# EAGLE design ProtoShieldBasic (EAGLE 6.3)
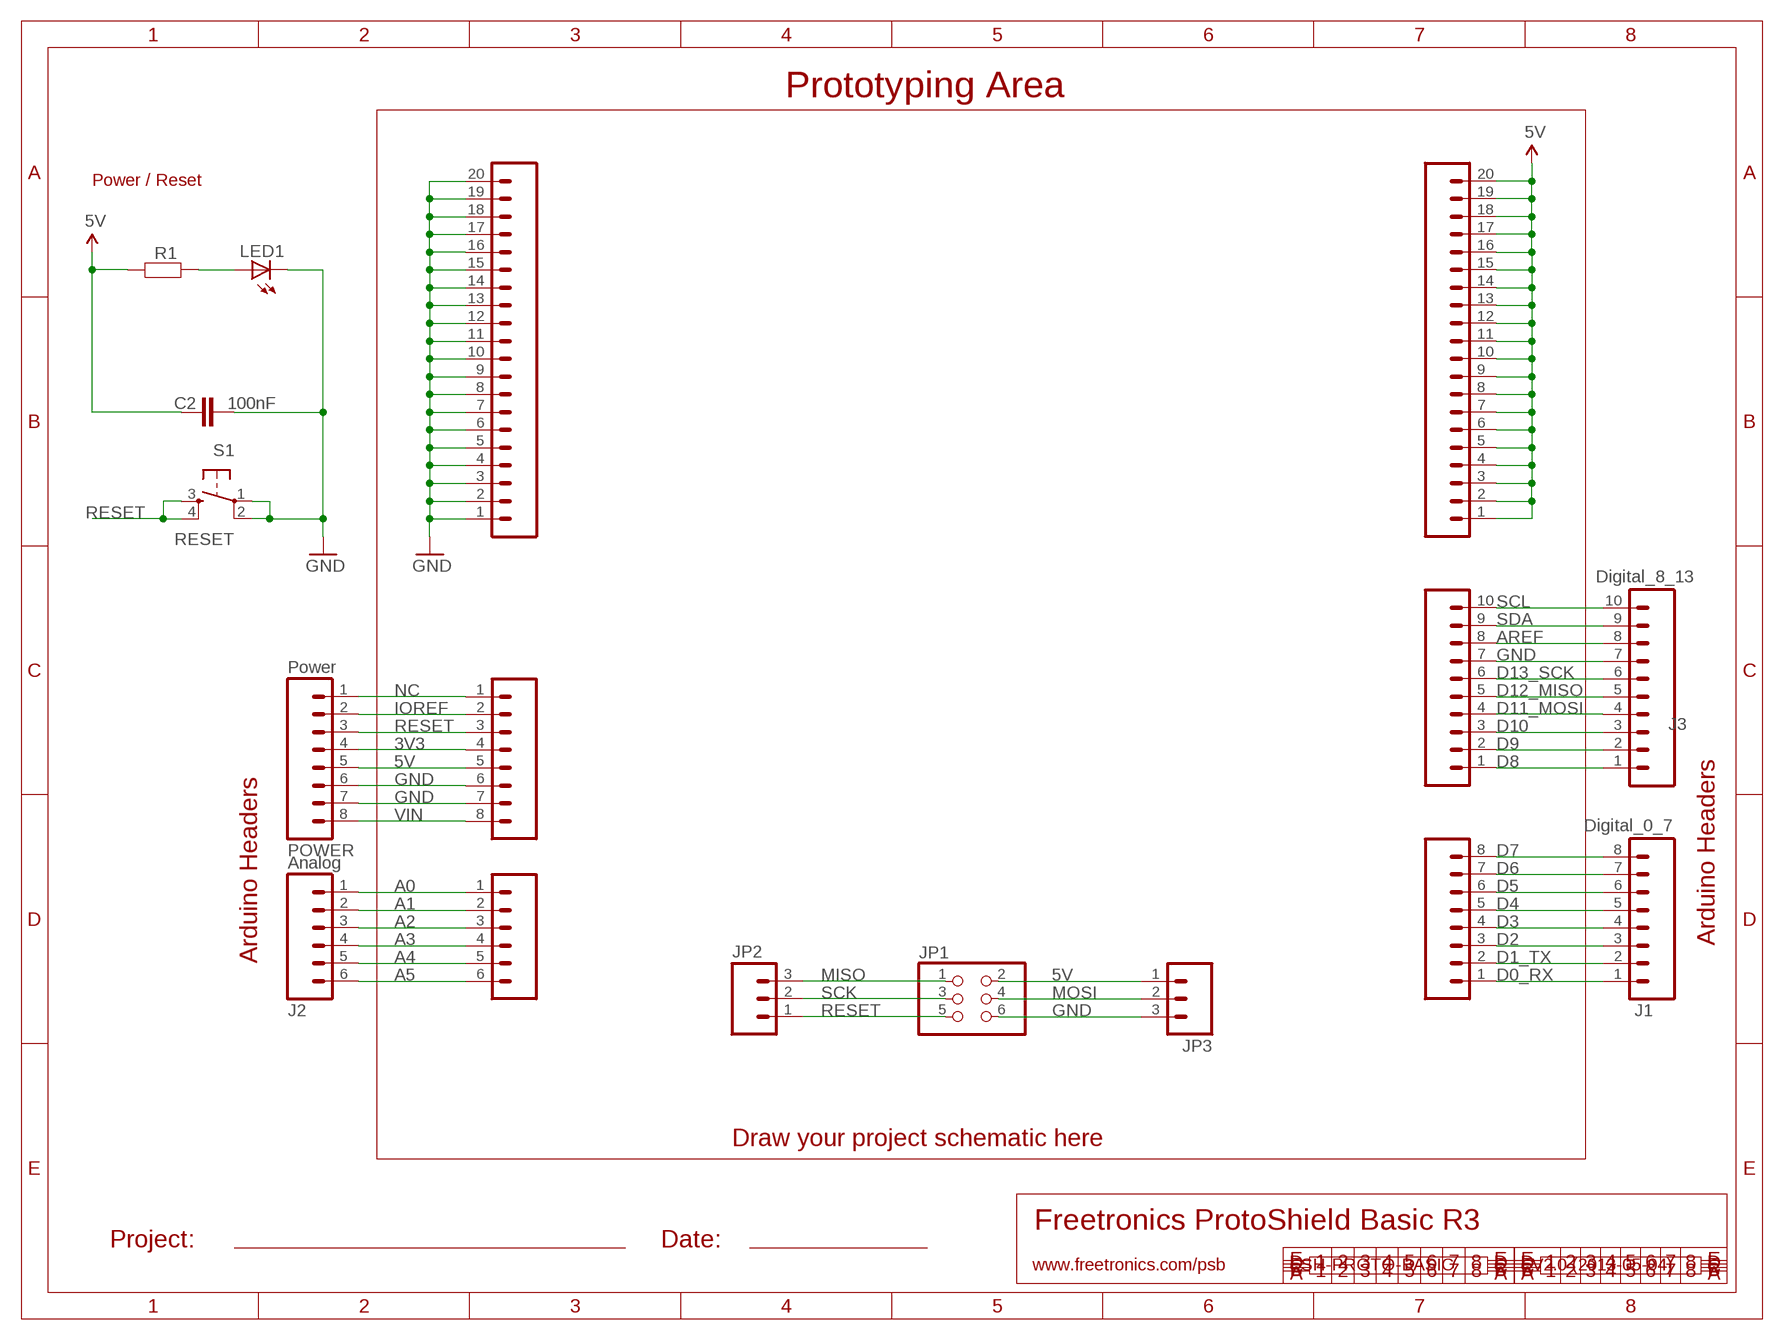
[diagram p0: schematic, sheet 1]

## Parts
C2  100nF  CAPPTH  [CAP-PTH-SMALL]
J1  Digital_0_7  M08  [1X08]
J2  Analog  M06SIP  [1X06]
J3  Digital_8_13  M100.1  [1X10]
JP1  PINHD-2X3  [2X03]
JP2  M03PTH  [1X03]
JP3  M03PTH  [1X03]
LED1  LED3MM  [LED3MM]
PADS_5V  M20  [1X20]
PADS_GND  M20  [1X20]
POWER  Power  M08  [1X08]
R1  RESISTORPTH1  [AXIAL-0.3]
S1  RESET  TAC_SWITCHPTH  [TACTILE-PTH]
SL1  Digital_0_7  M08  [1X08]
SL2  Analog  M06SIP  [1X06]
SL3  Digital_8_13  M100.1  [1X10]
SLP  Power  M08  [1X08]

## Nets
3V3: POWER.4 SLP.4
5V: C2.1 JP1.2 JP3.1 PADS_5V.1 PADS_5V.2 PADS_5V.3 PADS_5V.4 PADS_5V.5 PADS_5V.6 PADS_5V.7 PADS_5V.8 PADS_5V.9 PADS_5V.10 PADS_5V.11 PADS_5V.12 PADS_5V.13 PADS_5V.14 PADS_5V.15 PADS_5V.16 PADS_5V.17 PADS_5V.18 PADS_5V.19 PADS_5V.20 POWER.5 R1.P$1 SLP.5
A0: J2.1 SL2.1
A1: J2.2 SL2.2
A2: J2.3 SL2.3
A3: J2.4 SL2.4
A4: J2.5 SL2.5
A5: J2.6 SL2.6
AREF: J3.8 SL3.8
D0_RX: J1.1 SL1.1
D1_TX: J1.2 SL1.2
D2: J1.3 SL1.3
D3: J1.4 SL1.4
D4: J1.5 SL1.5
D5: J1.6 SL1.6
D6: J1.7 SL1.7
D7: J1.8 SL1.8
D8: J3.1 SL3.1
D9: J3.2 SL3.2
D10: J3.3 SL3.3
D11_MOSI: J3.4 SL3.4
D12_MISO: J3.5 SL3.5
D13_SCK: J3.6 SL3.6
GND: C2.2 J3.7 JP1.6 JP3.3 LED1.K(C) PADS_GND.1 PADS_GND.2 PADS_GND.3 PADS_GND.4 PADS_GND.5 PADS_GND.6 PADS_GND.7 PADS_GND.8 PADS_GND.9 PADS_GND.10 PADS_GND.11 PADS_GND.12 PADS_GND.13 PADS_GND.14 PADS_GND.15 PADS_GND.16 PADS_GND.17 PADS_GND.18 PADS_GND.19 PADS_GND.20 POWER.6 POWER.7 S1.1 S1.2 SL3.7 SLP.6 SLP.7
IOREF: POWER.2 SLP.2
MISO: JP1.1 JP2.3
MOSI: JP1.4 JP3.2
N$1: LED1.A R1.P$2
NC: POWER.1 SLP.1
RESET: JP1.5 JP2.1 POWER.3 S1.3 S1.4 SLP.3
SCK: JP1.3 JP2.2
SCL: J3.10 SL3.10
SDA: J3.9 SL3.9
VIN: POWER.8 SLP.8

## Notes on the sheet
- Prototyping Area
- Power / Reset
- Arduino Headers
- Arduino Headers
- Draw your project schematic here
- Freetronics ProtoShield Basic R3
- Project: | Date:
- www.freetronics.com/psb | SH-PROTO-BASIC | V2.0 (2013-05-04)

## Library data of the parts
C2 = freetronics:CAP: Capacitor Standard 0603 ceramic capacitor, and 0.1" leaded capacitor.
J1 SL1 = freetronics:M08: Header 8 Standard 8-pin 0.1" header. Use with straight break away headers (SKU : PRT-00116), right angle break away headers (PRT-00553), swiss pins (PRT-00743), machine pins (PRT-00117), and female headers (PRT-00115).
J2 SL2 = freetronics:M06: Header 6 Standard 6-pin 0.1" header. Use with straight break away headers (SKU : PRT-00116), right angle break away headers (PRT-00553), swiss pins (PRT-00743), machine pins (PRT-00117), and female headers (PRT-00115). Molex polarized connector foot print use with SKU : PRT-08094 with associated crimp pins and housings. NOTES ON THE VARIANTS LOCK and LOCK_LONGPADS... This footprint was designed to help hold the alignment of a through-hole component (i.e. 6-pin header) while soldering it into place. You may notice that each hole has been shifted either up or down by 0.005 of an inch from it's more standard position (which is a perfectly straight line). This slight alteration caused the pins (the squares in the middle) to touch the edges of the holes. Because they are alternating, it causes a "brace" to hold the component in place. 0.005 has proven to be the perfect amount of "off-center" position when using our standard breakaway headers. Although looks a little odd when you look at the bare footprint, once you have a header in there, the alteration is very hard to notice. Also, if you push a header all the way into place, it is covered up entirely on the bottom side. This idea of altering the position of holes to aid alignment will be further integrated into the Sparkfun Library for other footprints. It can help hold any component with 3 or more connection pins.
J3 SL3 = freetronics-original:M10: Header 10 Standard 10-pin 0.1" header. Use with straight break away headers (SKU : PRT-00116), right angle break away headers (PRT-00553), swiss pins (PRT-00743), machine pins (PRT-00117), and female headers (PRT-00115).
JP1 = freetronics-master-v1.1:PINHD-2X3: PIN HEADER
JP2 JP3 = freetronics-master-v1.1:M03: Header 3 Standard 3-pin 0.1" header. Use with straight break away headers (SKU : PRT-00116), right angle break away headers (PRT-00553), swiss pins (PRT-00743), machine pins (PRT-00117), and female headers (PRT-00115). Molex polarized connector foot print use with SKU : PRT-08232 with associated crimp pins and housings.
LED1 = freetronics:LED: LEDs Standard schematic elements and footprints for 5mm, 3mm, 1206, and 0603 sized LEDs. 5mm - Spark Fun Electronics SKU : COM-00529 (and others)
PADS_5V PADS_GND = freetronics:M20: This is just like the LOCK variant in that the holes are staggared by 5 mil, but except for the last two holes. They are not altered from the "standard" footprint layout. This is used for a special purpose on the layout of our Graphic LCD Backpack. Make sure you want to use this device before selecting it for you project!
POWER SLP = freetronics-original:M08: Header 8 Standard 8-pin 0.1" header. Use with straight break away headers (SKU : PRT-00116), right angle break away headers (PRT-00553), swiss pins (PRT-00743), machine pins (PRT-00117), and female headers (PRT-00115).
R1 = freetronics:RESISTOR: Resistor Basic schematic elements and footprints for 0603, 1206, and PTH 1/10th watt (small) resistors.
S1 = freetronics:TAC_SWITCH: Momentary Switch Button commonly used for reset or general input. Spark Fun Electronics SKU : COM-00097

## Board
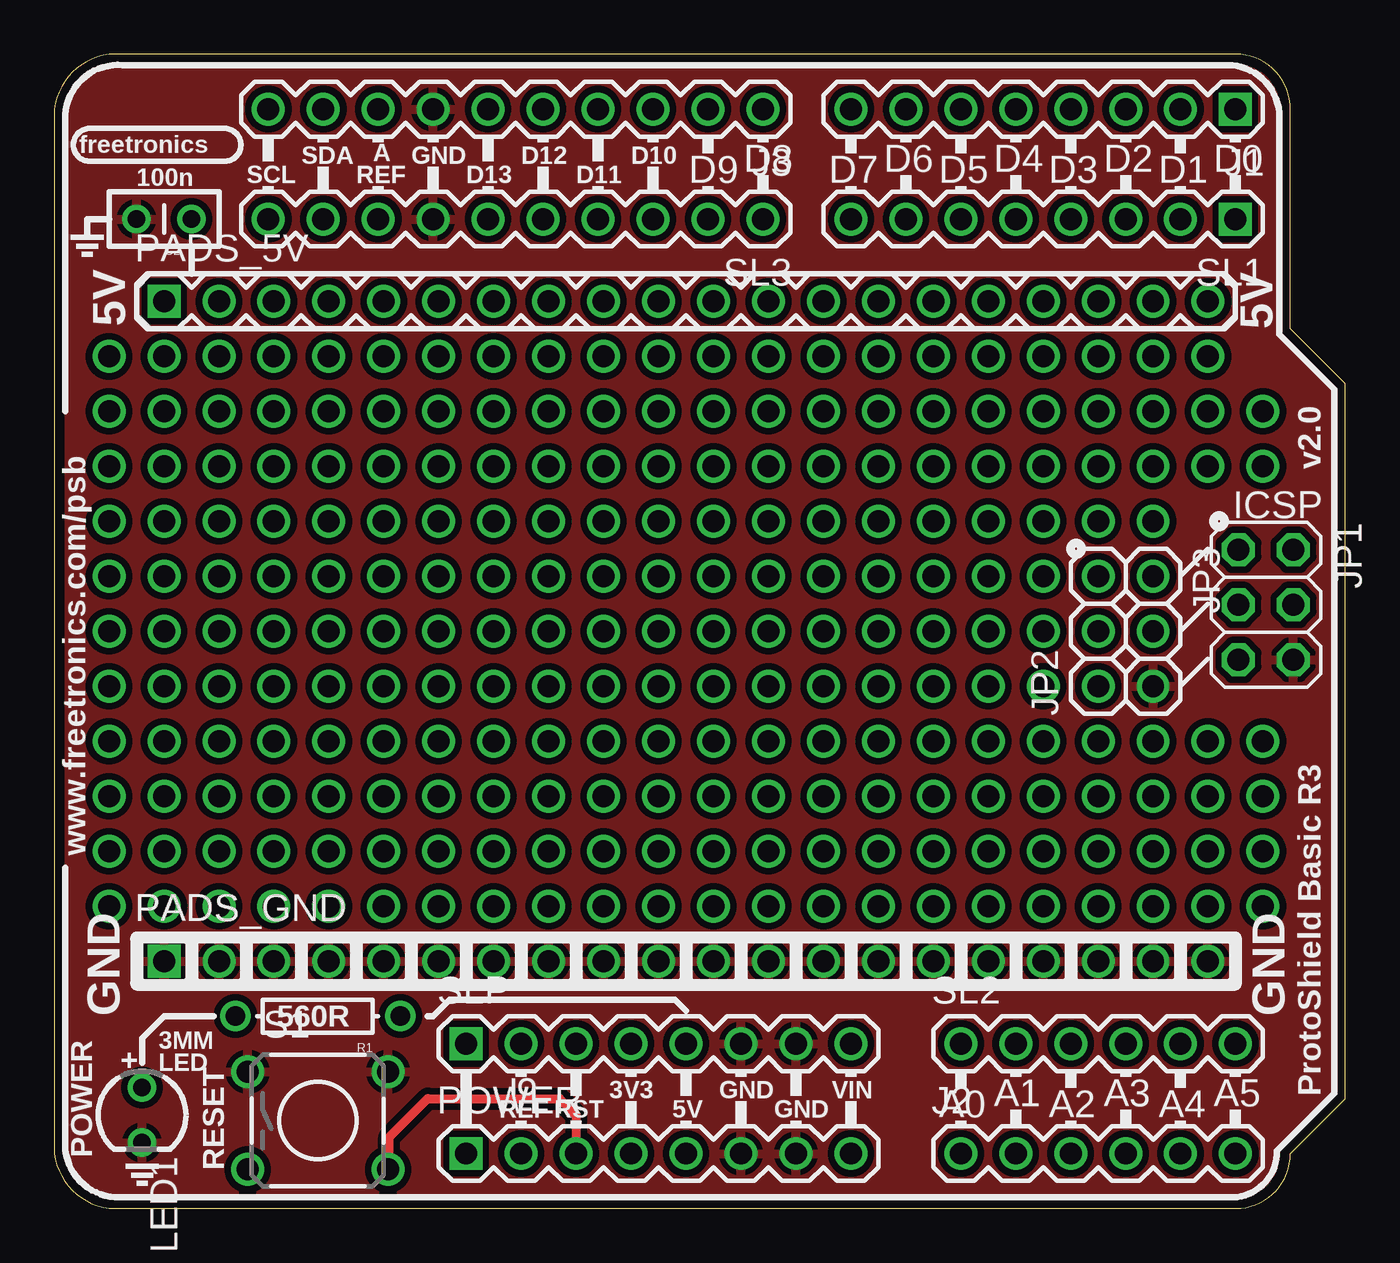
[diagram p1: board, top side]
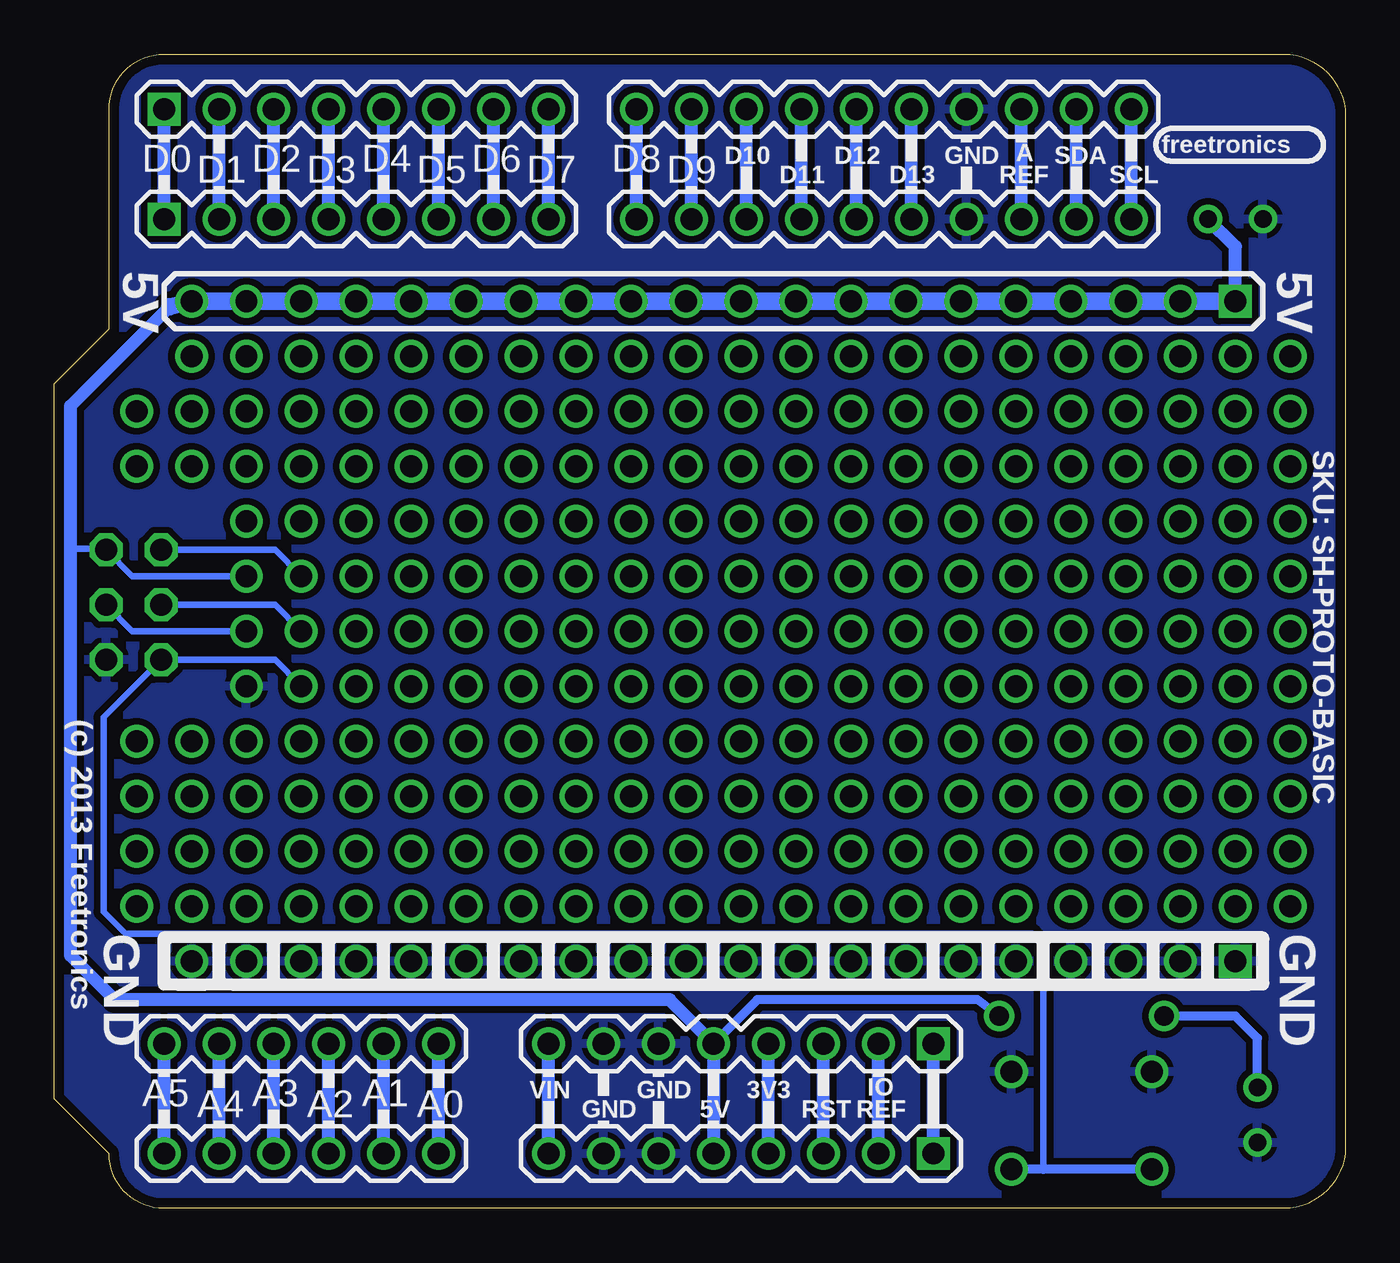
[diagram p2: board, bottom side, seen from below]

Size 59.69 x 53.34 mm. Coordinates in mm from the lower left corner, seen from the top.
Outline: 0,2.54 arc74 2.54,0 54.61,0 arc90 57.15,2.54 59.69,5.08 59.69,38.1 57.15,40.64 57.15,50.8 arc90 54.61,53.34 2.54,53.34 arc74 0,50.8 0,2.54
Copper layers (1*16): Top 0.035mm / dielectric 1.5mm / Bottom 0.035mm
Design rules "default *": minimum track width 10mil, minimum drill 24mil, track to track 12mil, track to pad 12mil, pad to pad 12mil, via to via 12mil, smd to smd 8mil, copper to edge 18mil, drill to drill 8mil, minimum pad ring 10mil, minimum via ring 8mil, stop-mask expansion 4mil, vias tented up to drill 0mil, thermal gap 10mil

### Footprints (pad centres in the part's own frame; a part is rotated, then mirrored left to right if it is on the bottom)
CAP-PTH-SMALL = drill 0.813: 1 0,0; 2 2.54,0
1X08 = drill 1.016 square: 1 0,0 | drill 1.016: 2 2.54,0; 3 5.08,0; 4 7.62,0; 5 10.16,0; 6 12.7,0; 7 15.24,0; 8 17.78,0
1X06 = drill 1.016: 1 0,0; 2 2.54,0; 3 5.08,0; 4 7.62,0; 5 10.16,0; 6 12.7,0
1X10 = drill 1.016: 1 0,0; 2 2.54,0; 3 5.08,0; 4 7.62,0; 5 10.16,0; 6 12.7,0; 7 15.24,0; 8 17.78,0; 9 20.32,0; 10 22.86,0
2X03 = drill 1.016 octagon: 1 -2.54,-1.27; 2 -2.54,1.27; 3 0,-1.27; 4 0,1.27; 5 2.54,-1.27; 6 2.54,1.27
1X03 = drill 1.016: 1 0,0; 2 2.54,0; 3 5.08,0
LED3MM = drill 0.813: A -1.27,0; K 1.27,0
1X20 = drill 1.016 square: 1 0,0 | drill 1.016: 2 2.54,0; 3 5.08,0; 4 7.62,0; 5 10.16,0; 6 12.7,0; 7 15.24,0; 8 17.78,0; 9 20.32,0; 10 22.86,0; 11 25.4,0; 12 27.94,0; 13 30.48,0; 14 33.02,0; 15 35.56,0; 16 38.1,0; 17 40.64,0; 18 43.18,0; 19 45.72,0; 20 48.26,0
AXIAL-0.3 = drill 0.9: P$1 -3.81,0; P$2 3.81,0
TACTILE-PTH = drill 1.016: 1 -3.251,2.261; 2 3.251,2.261; 3 -3.251,-2.261; 4 3.251,-2.261

### Placement (x,y rotation side)
C2  6.35,45.72 180 top
J1  54.61,50.8 180 top
J2  41.91,2.54 0 top
J3  32.77,50.8 180 top
JP1  56.02,27.89 270 top
JP2  48.26,24.13 90 top
JP3  50.8,29.21 270 top
LED1  4.06,4.32 270 top
PADS_5V  5.08,41.91 0 top
PADS_GND  5.08,11.43 0 top
POWER  19.05,2.54 0 top
R1  12.19,8.89 180 top
S1  12.19,4.06 0 top
SL1  54.61,45.72 180 top
SL2  41.91,7.62 0 top
SL3  32.77,45.72 180 top
SLP  19.05,7.62 0 top

### Tracks (layer width: path | path; a pad name or v marks a point on that pad's centre or on a via)
3V3
  Bottom 0.61: POWER.4 SLP.4
5V
  Bottom 0.305: JP3.1 56.07,29.21 JP1.2 57.34,30.48 58.93,30.48
  Bottom 0.406: R1.P$1 17.02,9.65 27.18,9.65 SLP.5
  Bottom 0.61: 54.36,41.66 58.93,37.08 58.93,30.48 58.93,11.68 56.9,9.65 31.24,9.65 SLP.5 POWER.5 | C2.1 5.08,44.45 PADS_5V.1
  Bottom 0.813: PADS_5V.20 PADS_5V.11 | PADS_5V.11 PADS_5V.12 PADS_5V.13 PADS_5V.14 PADS_5V.15 PADS_5V.16 PADS_5V.17 PADS_5V.18 PADS_5V.19 PADS_5V.20 | PADS_5V.11 PADS_5V.10 PADS_5V.9 PADS_5V.8 PADS_5V.7 PADS_5V.6 PADS_5V.5 PADS_5V.4 PADS_5V.3 PADS_5V.2 PADS_5V.1 | 54.36,41.66 PADS_5V.20
A0
  Bottom 0.61: J2.1 SL2.1
A1
  Bottom 0.61: J2.2 SL2.2
A2
  Bottom 0.61: J2.3 SL2.3
A3
  Bottom 0.61: J2.4 SL2.4
A4
  Bottom 0.61: J2.5 SL2.5
A5
  Bottom 0.61: J2.6 SL2.6
AREF
  Bottom 0.61: SL3.8 J3.8
D0_RX
  Bottom 0.61: SL1.1 J1.1
D1_TX
  Bottom 0.61: SL1.2 J1.2
D2
  Bottom 0.61: SL1.3 J1.3
D3
  Bottom 0.61: SL1.4 J1.4
D4
  Bottom 0.61: SL1.5 J1.5
D5
  Bottom 0.61: SL1.6 J1.6
D6
  Bottom 0.61: SL1.7 J1.7
D7
  Bottom 0.61: SL1.8 J1.8
D8
  Bottom 0.61: SL3.1 J3.1
D9
  Bottom 0.61: SL3.2 J3.2
D10
  Bottom 0.61: SL3.3 J3.3
D11_MOSI
  Bottom 0.61: SL3.4 J3.4
D12_MISO
  Bottom 0.61: SL3.5 J3.5
D13_SCK
  Bottom 0.61: SL3.6 J3.6
GND
  pour Bottom: 0,50.8 arc-74 2.54,53.34 54.61,53.34 arc-74 57.15,50.8 57.15,40.64 59.69,38.1 59.69,5.08 57.15,2.54 arc-74 54.61,0 2.54,0 arc-74 0,2.54
  pour Top: 0,50.8 arc-74 2.54,53.34 54.61,53.34 arc-74 57.15,50.8 57.15,40.64 59.69,38.1 59.69,5.08 57.15,2.54 arc-74 54.61,0 2.54,0 arc-74 0,2.54
IOREF
  Bottom 0.61: POWER.2 SLP.2
MISO
  Bottom 0.305: JP2.3 49.48,30.43 JP1.1
MOSI
  Bottom 0.305: JP3.2 56.07,26.67 JP1.4
N$1
  Bottom 0.406: LED1.A 4.06,7.87 5.08,8.89 R1.P$2
N$5  (via drill 1.02)
  other vias: 50.8,13.97
N$7  (via drill 1.02)
  other vias: 48.26,13.97
N$8  (via drill 1.02)
  other vias: 45.72,13.97
N$9  (via drill 1.02)
  other vias: 43.18,13.97
N$10  (via drill 1.02)
  other vias: 40.64,13.97
N$11  (via drill 1.02)
  other vias: 38.1,13.97
N$12  (via drill 1.02)
  other vias: 35.56,13.97
N$13  (via drill 1.02)
  other vias: 33.02,13.97
N$14  (via drill 1.02)
  other vias: 30.48,13.97
N$15  (via drill 1.02)
  other vias: 27.94,13.97
N$16  (via drill 1.02)
  other vias: 25.4,13.97
N$17  (via drill 1.02)
  other vias: 22.86,13.97
N$18  (via drill 1.02)
  other vias: 20.32,13.97
N$19  (via drill 1.02)
  other vias: 17.78,13.97
N$20  (via drill 1.02)
  other vias: 15.24,13.97
N$21  (via drill 1.02)
  other vias: 12.7,13.97
N$22  (via drill 1.02)
  other vias: 50.8,16.51
N$23  (via drill 1.02)
  other vias: 48.26,16.51
N$24  (via drill 1.02)
  other vias: 45.72,16.51
N$25  (via drill 1.02)
  other vias: 43.18,16.51
N$26  (via drill 1.02)
  other vias: 40.64,16.51
N$27  (via drill 1.02)
  other vias: 38.1,16.51
N$28  (via drill 1.02)
  other vias: 35.56,16.51
N$29  (via drill 1.02)
  other vias: 33.02,16.51
N$30  (via drill 1.02)
  other vias: 30.48,16.51
N$31  (via drill 1.02)
  other vias: 27.94,16.51
N$32  (via drill 1.02)
  other vias: 25.4,16.51
N$33  (via drill 1.02)
  other vias: 22.86,16.51
N$34  (via drill 1.02)
  other vias: 20.32,16.51
N$35  (via drill 1.02)
  other vias: 17.78,16.51
N$36  (via drill 1.02)
  other vias: 15.24,16.51
N$37  (via drill 1.02)
  other vias: 12.7,16.51
N$38  (via drill 1.02)
  other vias: 50.8,19.05
N$39  (via drill 1.02)
  other vias: 48.26,19.05
N$40  (via drill 1.02)
  other vias: 45.72,19.05
N$41  (via drill 1.02)
  other vias: 43.18,19.05
N$42  (via drill 1.02)
  other vias: 40.64,19.05
N$43  (via drill 1.02)
  other vias: 38.1,19.05
N$44  (via drill 1.02)
  other vias: 35.56,19.05
N$45  (via drill 1.02)
  other vias: 33.02,19.05
N$46  (via drill 1.02)
  other vias: 30.48,19.05
N$47  (via drill 1.02)
  other vias: 27.94,19.05
N$48  (via drill 1.02)
  other vias: 25.4,19.05
N$49  (via drill 1.02)
  other vias: 22.86,19.05
N$50  (via drill 1.02)
  other vias: 20.32,19.05
N$51  (via drill 1.02)
  other vias: 17.78,19.05
N$52  (via drill 1.02)
  other vias: 15.24,19.05
N$53  (via drill 1.02)
  other vias: 12.7,19.05
N$54  (via drill 1.02)
  other vias: 50.8,21.59
N$55  (via drill 1.02)
  other vias: 48.26,21.59
N$56  (via drill 1.02)
  other vias: 45.72,21.59
N$57  (via drill 1.02)
  other vias: 43.18,21.59
N$58  (via drill 1.02)
  other vias: 40.64,21.59
N$59  (via drill 1.02)
  other vias: 38.1,21.59
N$60  (via drill 1.02)
  other vias: 35.56,21.59
N$61  (via drill 1.02)
  other vias: 33.02,21.59
N$62  (via drill 1.02)
  other vias: 30.48,21.59
N$63  (via drill 1.02)
  other vias: 27.94,21.59
N$64  (via drill 1.02)
  other vias: 25.4,21.59
N$65  (via drill 1.02)
  other vias: 22.86,21.59
N$66  (via drill 1.02)
  other vias: 20.32,21.59
N$67  (via drill 1.02)
  other vias: 17.78,21.59
N$68  (via drill 1.02)
  other vias: 15.24,21.59
N$69  (via drill 1.02)
  other vias: 12.7,21.59
N$70  (via drill 1.02)
  other vias: 50.8,31.75
N$71  (via drill 1.02)
  other vias: 48.26,31.75
N$72  (via drill 1.02)
  other vias: 45.72,24.13
N$73  (via drill 1.02)
  other vias: 43.18,24.13
N$74  (via drill 1.02)
  other vias: 40.64,24.13
N$75  (via drill 1.02)
  other vias: 38.1,24.13
N$76  (via drill 1.02)
  other vias: 35.56,24.13
N$77  (via drill 1.02)
  other vias: 33.02,24.13
N$78  (via drill 1.02)
  other vias: 30.48,24.13
N$79  (via drill 1.02)
  other vias: 27.94,24.13
N$80  (via drill 1.02)
  other vias: 25.4,24.13
N$81  (via drill 1.02)
  other vias: 22.86,24.13
N$82  (via drill 1.02)
  other vias: 20.32,24.13
N$83  (via drill 1.02)
  other vias: 17.78,24.13
N$84  (via drill 1.02)
  other vias: 15.24,24.13
N$85  (via drill 1.02)
  other vias: 12.7,24.13
N$88  (via drill 1.02)
  other vias: 45.72,26.67
N$89  (via drill 1.02)
  other vias: 43.18,26.67
N$90  (via drill 1.02)
  other vias: 40.64,26.67
N$91  (via drill 1.02)
  other vias: 38.1,26.67
N$92  (via drill 1.02)
  other vias: 35.56,26.67
N$93  (via drill 1.02)
  other vias: 33.02,26.67
N$94  (via drill 1.02)
  other vias: 30.48,26.67
N$95  (via drill 1.02)
  other vias: 27.94,26.67
N$96  (via drill 1.02)
  other vias: 25.4,26.67
N$97  (via drill 1.02)
  other vias: 22.86,26.67
N$98  (via drill 1.02)
  other vias: 20.32,26.67
N$99  (via drill 1.02)
  other vias: 17.78,26.67
N$100  (via drill 1.02)
  other vias: 15.24,26.67
N$101  (via drill 1.02)
  other vias: 12.7,26.67
N$104  (via drill 1.02)
  other vias: 45.72,29.21
N$105  (via drill 1.02)
  other vias: 43.18,29.21
N$106  (via drill 1.02)
  other vias: 40.64,29.21
N$107  (via drill 1.02)
  other vias: 38.1,29.21
N$108  (via drill 1.02)
  other vias: 35.56,29.21
N$109  (via drill 1.02)
  other vias: 33.02,29.21
N$110  (via drill 1.02)
  other vias: 30.48,29.21
N$111  (via drill 1.02)
  other vias: 27.94,29.21
N$112  (via drill 1.02)
  other vias: 25.4,29.21
N$113  (via drill 1.02)
  other vias: 22.86,29.21
N$114  (via drill 1.02)
  other vias: 20.32,29.21
N$115  (via drill 1.02)
  other vias: 17.78,29.21
N$116  (via drill 1.02)
  other vias: 15.24,29.21
N$117  (via drill 1.02)
  other vias: 12.7,29.21
N$120  (via drill 1.02)
  other vias: 45.72,31.75
N$121  (via drill 1.02)
  other vias: 43.18,31.75
N$122  (via drill 1.02)
  other vias: 40.64,31.75
N$123  (via drill 1.02)
  other vias: 38.1,31.75
N$124  (via drill 1.02)
  other vias: 35.56,31.75
N$125  (via drill 1.02)
  other vias: 33.02,31.75
N$126  (via drill 1.02)
  other vias: 30.48,31.75
N$127  (via drill 1.02)
  other vias: 27.94,31.75
N$128  (via drill 1.02)
  other vias: 25.4,31.75
N$129  (via drill 1.02)
  other vias: 22.86,31.75
N$130  (via drill 1.02)
  other vias: 20.32,31.75
N$131  (via drill 1.02)
  other vias: 17.78,31.75
N$132  (via drill 1.02)
  other vias: 15.24,31.75
N$133  (via drill 1.02)
  other vias: 12.7,31.75
N$134  (via drill 1.02)
  other vias: 50.8,34.29
N$135  (via drill 1.02)
  other vias: 48.26,34.29
N$136  (via drill 1.02)
  other vias: 45.72,34.29
N$137  (via drill 1.02)
  other vias: 43.18,34.29
N$138  (via drill 1.02)
  other vias: 40.64,34.29
N$139  (via drill 1.02)
  other vias: 38.1,34.29
N$140  (via drill 1.02)
  other vias: 35.56,34.29
N$141  (via drill 1.02)
  other vias: 33.02,34.29
N$142  (via drill 1.02)
  other vias: 30.48,34.29
N$143  (via drill 1.02)
  other vias: 27.94,34.29
N$144  (via drill 1.02)
  other vias: 25.4,34.29
N$145  (via drill 1.02)
  other vias: 22.86,34.29
N$146  (via drill 1.02)
  other vias: 20.32,34.29
N$147  (via drill 1.02)
  other vias: 17.78,34.29
N$148  (via drill 1.02)
  other vias: 15.24,34.29
N$149  (via drill 1.02)
  other vias: 12.7,34.29
N$150  (via drill 1.02)
  other vias: 50.8,36.83
N$151  (via drill 1.02)
  other vias: 48.26,36.83
N$152  (via drill 1.02)
  other vias: 45.72,36.83
N$153  (via drill 1.02)
  other vias: 43.18,36.83
N$154  (via drill 1.02)
  other vias: 40.64,36.83
N$155  (via drill 1.02)
  other vias: 38.1,36.83
N$156  (via drill 1.02)
  other vias: 35.56,36.83
N$157  (via drill 1.02)
  other vias: 33.02,36.83
N$158  (via drill 1.02)
  other vias: 30.48,36.83
N$159  (via drill 1.02)
  other vias: 27.94,36.83
N$160  (via drill 1.02)
  other vias: 25.4,36.83
N$161  (via drill 1.02)
  other vias: 22.86,36.83
N$162  (via drill 1.02)
  other vias: 20.32,36.83
N$163  (via drill 1.02)
  other vias: 17.78,36.83
N$164  (via drill 1.02)
  other vias: 15.24,36.83
N$165  (via drill 1.02)
  other vias: 12.7,36.83
N$166  (via drill 1.02)
  other vias: 50.8,39.37
N$167  (via drill 1.02)
  other vias: 48.26,39.37
N$168  (via drill 1.02)
  other vias: 45.72,39.37
N$169  (via drill 1.02)
  other vias: 43.18,39.37
N$170  (via drill 1.02)
  other vias: 40.64,39.37
N$171  (via drill 1.02)
  other vias: 38.1,39.37
N$172  (via drill 1.02)
  other vias: 35.56,39.37
N$173  (via drill 1.02)
  other vias: 33.02,39.37
N$174  (via drill 1.02)
  other vias: 30.48,39.37
N$175  (via drill 1.02)
  other vias: 27.94,39.37
N$176  (via drill 1.02)
  other vias: 25.4,39.37
N$177  (via drill 1.02)
  other vias: 22.86,39.37
N$178  (via drill 1.02)
  other vias: 20.32,39.37
N$179  (via drill 1.02)
  other vias: 17.78,39.37
N$180  (via drill 1.02)
  other vias: 15.24,39.37
N$181  (via drill 1.02)
  other vias: 12.7,39.37
N$182  (via drill 1.02)
  other vias: 53.34,13.97
N$183  (via drill 1.02)
  other vias: 53.34,16.51
N$184  (via drill 1.02)
  other vias: 53.34,19.05
N$185  (via drill 1.02)
  other vias: 53.34,21.59
N$190  (via drill 1.02)
  other vias: 53.34,34.29
N$191  (via drill 1.02)
  other vias: 53.34,36.83
N$193  (via drill 1.02)
  other vias: 55.88,13.97
N$194  (via drill 1.02)
  other vias: 55.88,16.51
N$195  (via drill 1.02)
  other vias: 55.88,19.05
N$196  (via drill 1.02)
  other vias: 55.88,21.59
N$201  (via drill 1.02)
  other vias: 55.88,34.29
N$202  (via drill 1.02)
  other vias: 55.88,36.83
N$203  (via drill 1.02)
  other vias: 53.34,39.37
N$204  (via drill 1.02)
  other vias: 10.16,13.97
N$205  (via drill 1.02)
  other vias: 10.16,16.51
N$206  (via drill 1.02)
  other vias: 10.16,19.05
N$207  (via drill 1.02)
  other vias: 10.16,21.59
N$208  (via drill 1.02)
  other vias: 10.16,24.13
N$209  (via drill 1.02)
  other vias: 10.16,26.67
N$210  (via drill 1.02)
  other vias: 10.16,29.21
N$211  (via drill 1.02)
  other vias: 10.16,31.75
N$212  (via drill 1.02)
  other vias: 10.16,34.29
N$213  (via drill 1.02)
  other vias: 10.16,36.83
N$214  (via drill 1.02)
  other vias: 10.16,39.37
N$215  (via drill 1.02)
  other vias: 7.62,13.97
N$216  (via drill 1.02)
  other vias: 7.62,16.51
N$217  (via drill 1.02)
  other vias: 7.62,19.05
N$218  (via drill 1.02)
  other vias: 7.62,21.59
N$219  (via drill 1.02)
  other vias: 7.62,24.13
N$220  (via drill 1.02)
  other vias: 7.62,26.67
N$221  (via drill 1.02)
  other vias: 7.62,29.21
N$222  (via drill 1.02)
  other vias: 7.62,31.75
N$223  (via drill 1.02)
  other vias: 7.62,34.29
N$224  (via drill 1.02)
  other vias: 7.62,36.83
N$225  (via drill 1.02)
  other vias: 7.62,39.37
N$226  (via drill 1.02)
  other vias: 5.08,13.97
N$227  (via drill 1.02)
  other vias: 5.08,16.51
N$228  (via drill 1.02)
  other vias: 5.08,19.05
N$229  (via drill 1.02)
  other vias: 5.08,21.59
N$230  (via drill 1.02)
  other vias: 5.08,24.13
N$231  (via drill 1.02)
  other vias: 5.08,26.67
N$232  (via drill 1.02)
  other vias: 5.08,29.21
N$233  (via drill 1.02)
  other vias: 5.08,31.75
N$234  (via drill 1.02)
  other vias: 5.08,34.29
N$235  (via drill 1.02)
  other vias: 5.08,36.83
N$236  (via drill 1.02)
  other vias: 5.08,39.37
N$237  (via drill 1.02)
  other vias: 2.54,13.97
N$238  (via drill 1.02)
  other vias: 2.54,16.51
N$239  (via drill 1.02)
  other vias: 2.54,19.05
N$240  (via drill 1.02)
  other vias: 2.54,21.59
N$241  (via drill 1.02)
  other vias: 2.54,24.13
N$242  (via drill 1.02)
  other vias: 2.54,26.67
N$243  (via drill 1.02)
  other vias: 2.54,29.21
N$244  (via drill 1.02)
  other vias: 2.54,31.75
N$245  (via drill 1.02)
  other vias: 2.54,34.29
N$246  (via drill 1.02)
  other vias: 2.54,36.83
N$247  (via drill 1.02)
  other vias: 2.54,39.37
NC
  Bottom 0.61: POWER.1 SLP.1
RESET
  Top 0.406: POWER.3 24.13,4.32 23.37,5.08 17.27,5.08 15.49,3.3 15.49,1.85 S1.4
  Bottom 0.305: JP2.1 49.48,25.35 JP1.5 57.4,22.7 57.4,13.72 56.39,12.7 14.48,12.7 13.97,12.19 13.97,1.8
  Bottom 0.406: S1.3 13.97,1.8 S1.4
  Bottom 0.61: POWER.3 SLP.3
SCK
  Bottom 0.305: JP2.2 49.48,27.89 JP1.3
SCL
  Bottom 0.61: SL3.10 J3.10
SDA
  Bottom 0.61: SL3.9 J3.9
VIN
  Bottom 0.61: POWER.8 SLP.8

### Text on the board
tPlace: freetronics | SDA | A | GND | D12 | D10 | D8 | D6 | D4 | D2 | D0 | 100n | SCL | REF | D13 | D11 | D9 | D7 | D5 | D3 | D1 | 5V | 5V | v2.0 | ICSP | www.freetronics.com/psb | GND | GND | 560R | 3MM | + | LED | IO | 3V3 | GND | VIN | A1 | A3 | A5 | ProtoShield Basic R3 | REF | RST | 5V | GND | A0 | A2 | A4 | POWER | RESET
bPlace: freetronics | SDA | A | GND | D12 | D10 | D8 | D6 | D4 | D2 | D0 | SCL | REF | D13 | D11 | D9 | D7 | D5 | D3 | D1 | 5V | 5V | SKU: SH-PROTO-BASIC | (c) 2013 Freetronics | GND | GND | IO | 3V3 | GND | VIN | A1 | A3 | A5 | REF | RST | 5V | GND | A0 | A2 | A4